# EasyEDA schematic Schematic.json
TITLE: Raspberry Pi Shield; REV: 1.0; Date: 2020-06-05; Sheet: 1/1; Drawn By: rdellios; Company: Your Company
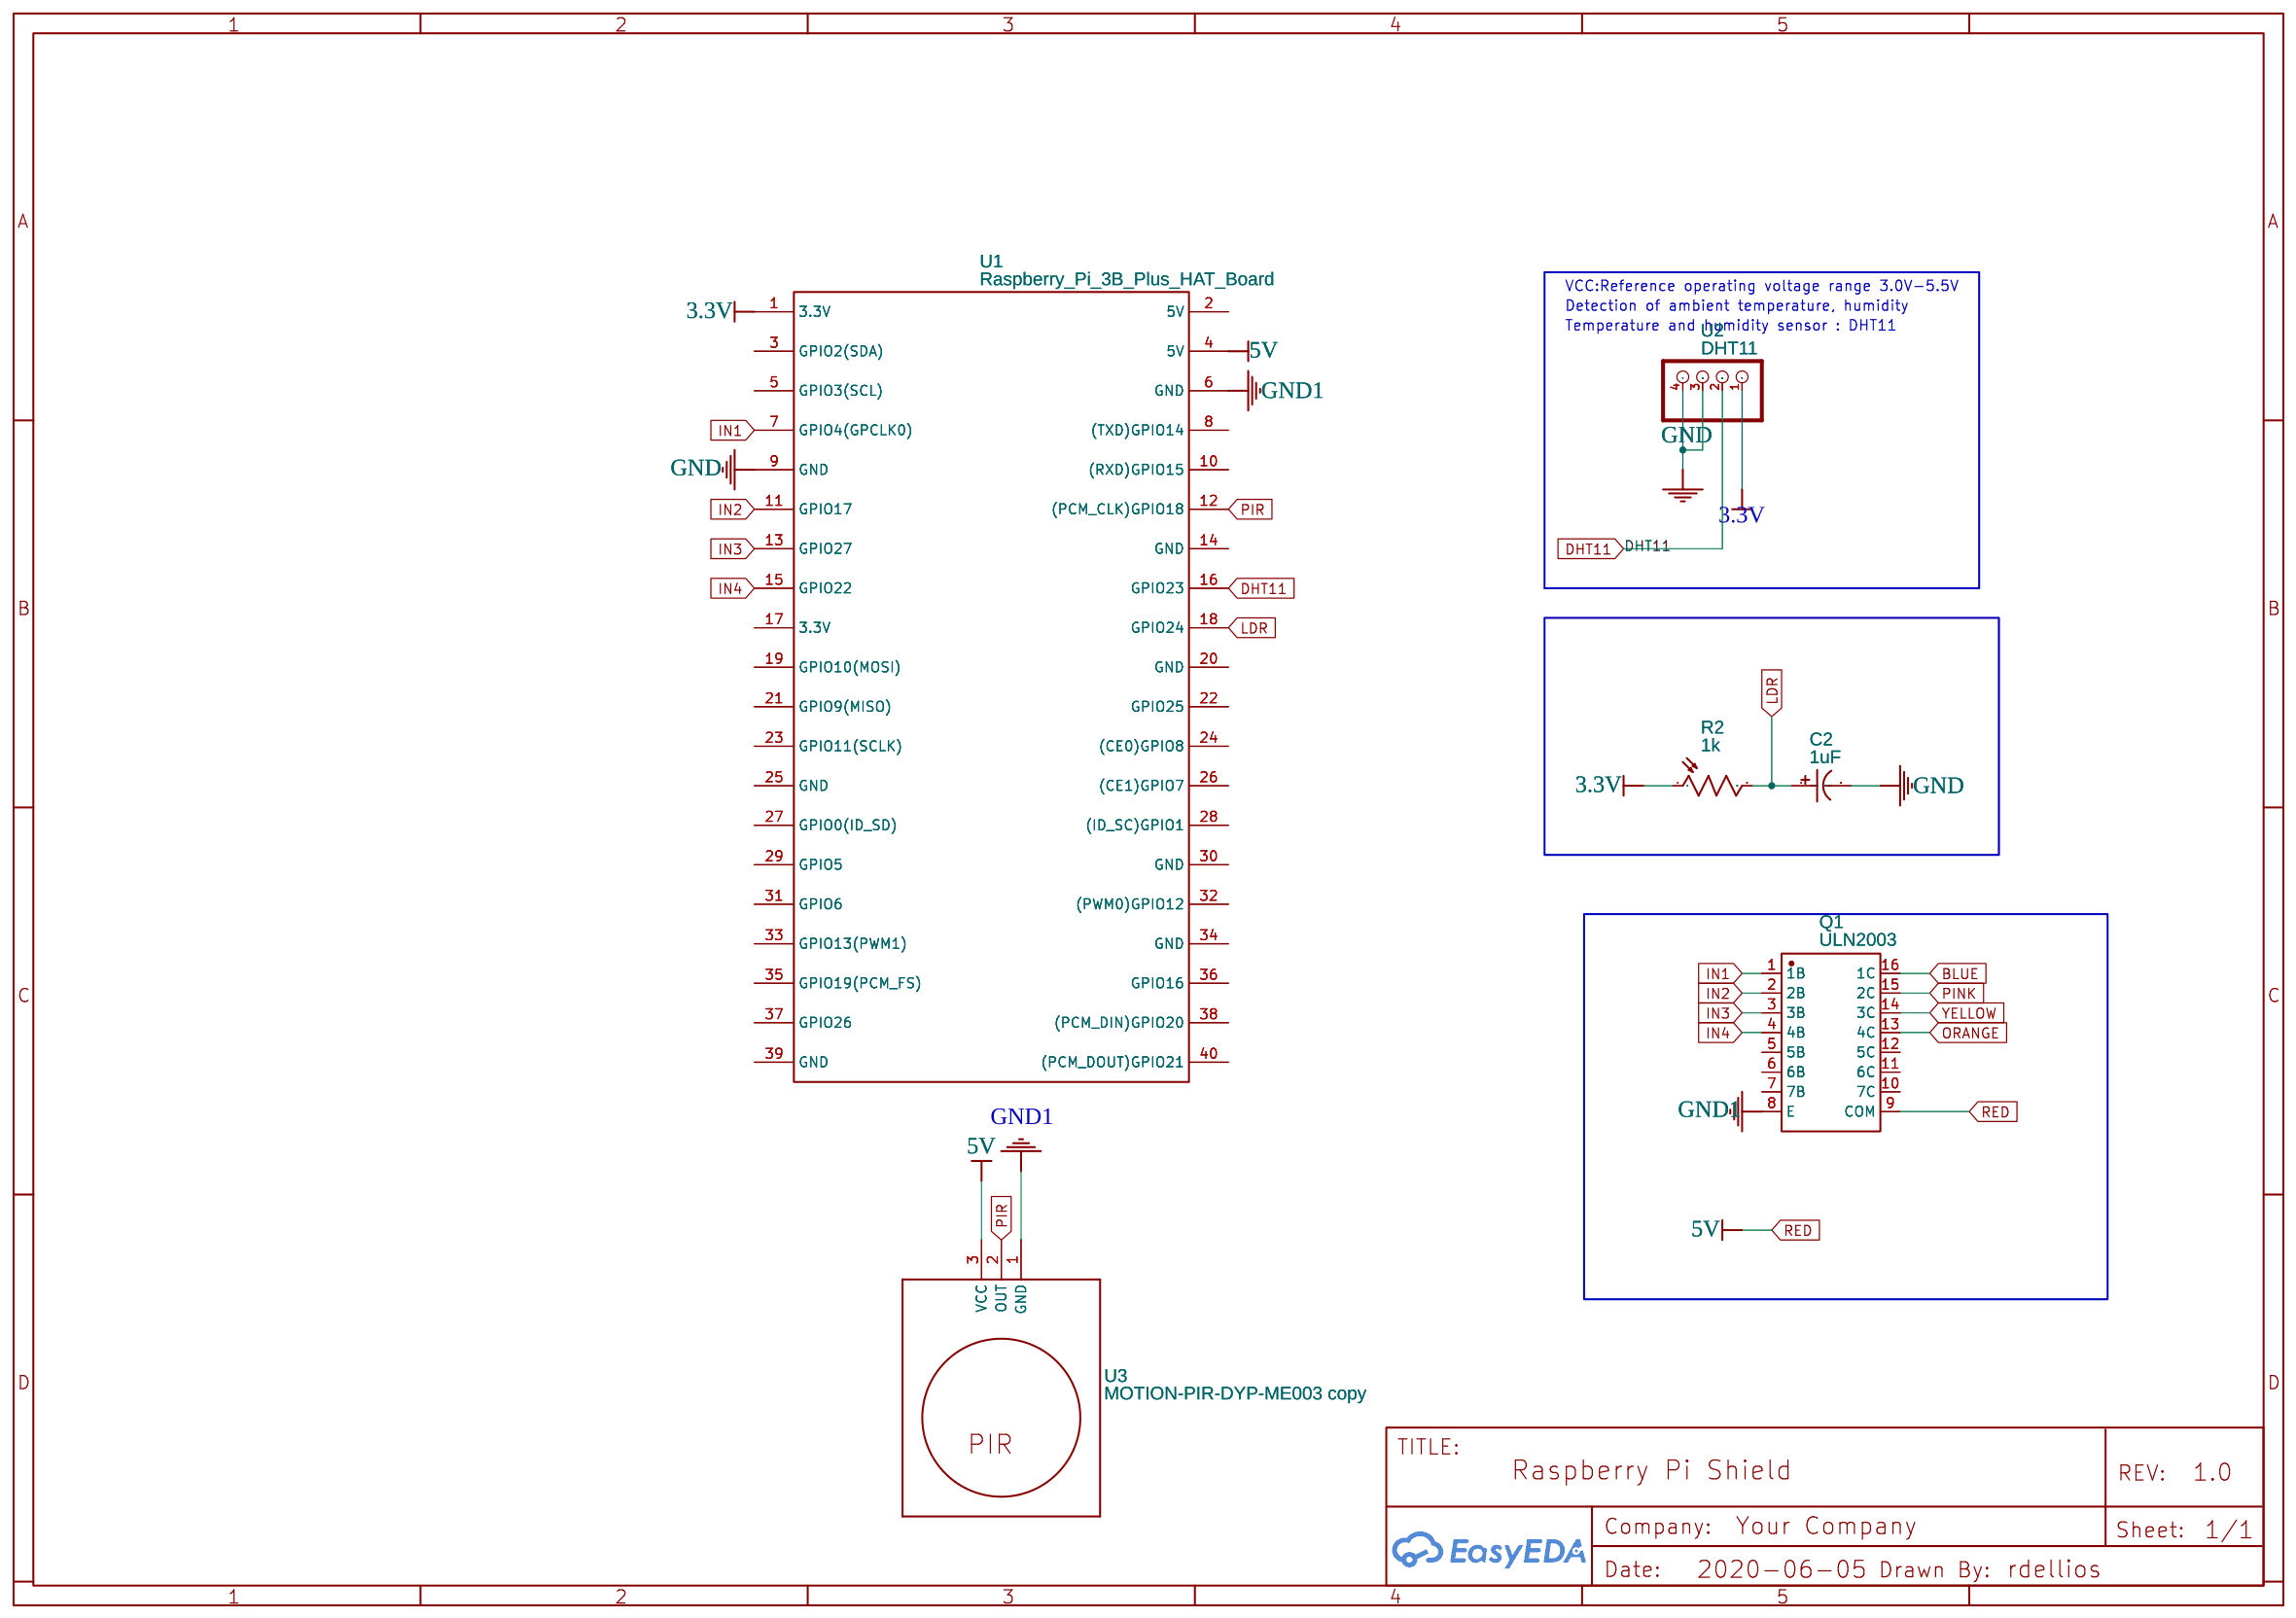
[diagram p0: schematic sheet]

## Parts
C2  1uF  [CAP-TH_BD4.0-P1.50-D0.8-FD]
Q1  ULN2003  [SOP-16_L10.0-W3.9-P1.27-LS6.0-BL]
R2  1k  [R3]
U1  Raspberry_Pi_3B_Plus_HAT_Board  [RASPBERRY_PI_3B_PLUS_HAT_BOARD]
U2  DHT11  [SENSOR-TH_DHT11]
U3  MOTION-PIR-DYP-ME003 copy  [MOTION-PIR-DYP-ME003]

## Library data of the parts
C2 = 1uF 50V 4*5: Supplier: LCSC; Manufacturer: ValuePro; Supplier Part: C47848
Q1 = ULN2003: Supplier: LCSC; Supplier Part: C411052; Manufacturer: Shanghai Siproin Microelectronics; Contributor: LCSC; LCSC Assembly: Yes; SMT Type: Extend
R2 = PhotoResistor
U1 = Raspberry_Pi_3B_Plus_HAT_Board: catid: 20; Contributor: lwweb; Manufacturer Part: Raspberry-Pi-3B-Plus-HAT-Board
U2 = -: catid: 20; sourceId: ec6oiAS9r; Manufacturer Part: ?
U3 = MOTION-PIR-DYP-ME003 copy: PIR Motion Sensor Module DYP-ME003 based on BISS0001 pyroelectic detector

## Nets
3.3V: R2.1 U1.1(3.3V) U2.1
5V: Q1.9(COM) U1.4(5V) U3.3(VCC)
GND: C2.2 U1.9(GND) U2.3 U2.4
GND1: Q1.8(E) U1.6(GND) U3.1(GND)
BLUE: Q1.16(1C)
DHT11: U1.16(GPIO23) U2.2
IN1: Q1.1(1B) U1.7(GPIO4(GPCLK0))
IN2: Q1.2(2B) U1.11(GPIO17)
IN3: Q1.3(3B) U1.13(GPIO27)
IN4: Q1.4(4B) U1.15(GPIO22)
LDR: C2.1 R2.2 U1.18(GPIO24)
ORANGE: Q1.13(4C)
PINK: Q1.15(2C)
PIR: U1.12((PCM_CLK)GPIO18) U3.2(OUT)
YELLOW: Q1.14(3C)

Not connected (* = marked no-connect by the designer): Q1 5(5B) 6(6B) 7(7B) 10(7C) 11(6C) 12(5C); U1 2(5V) 3(GPIO2(SDA)) 5(GPIO3(SCL)) 8((TXD)GPIO14) 10((RXD)GPIO15) 14(GND) 17(3.3V) 19(GPIO10(MOSI)) 20(GND) 21(GPIO9(MISO)) 22(GPIO25) 23(GPIO11(SCLK)) 24((CE0)GPIO8) 25(GND) 26((CE1)GPIO7) 27(GPIO0(ID_SD)) 28((ID_SC)GPIO1) 29(GPIO5) 30(GND) 31(GPIO6) 32((PWM0)GPIO12) 33(GPIO13(PWM1)) 34(GND) 35(GPIO19(PCM_FS)) 36(GPIO16) 37(GPIO26) 38((PCM_DIN)GPIO20) 39(GND) 40((PCM_DOUT)GPIO21)

## Notes on the sheet
- VCC:Reference operating voltage range 3.0V-5.5V
- Detection of ambient temperature, humidity
- Temperature and humidity sensor : DHT11
